# EAGLE design Color-LCD-Shield (EAGLE 5.11)
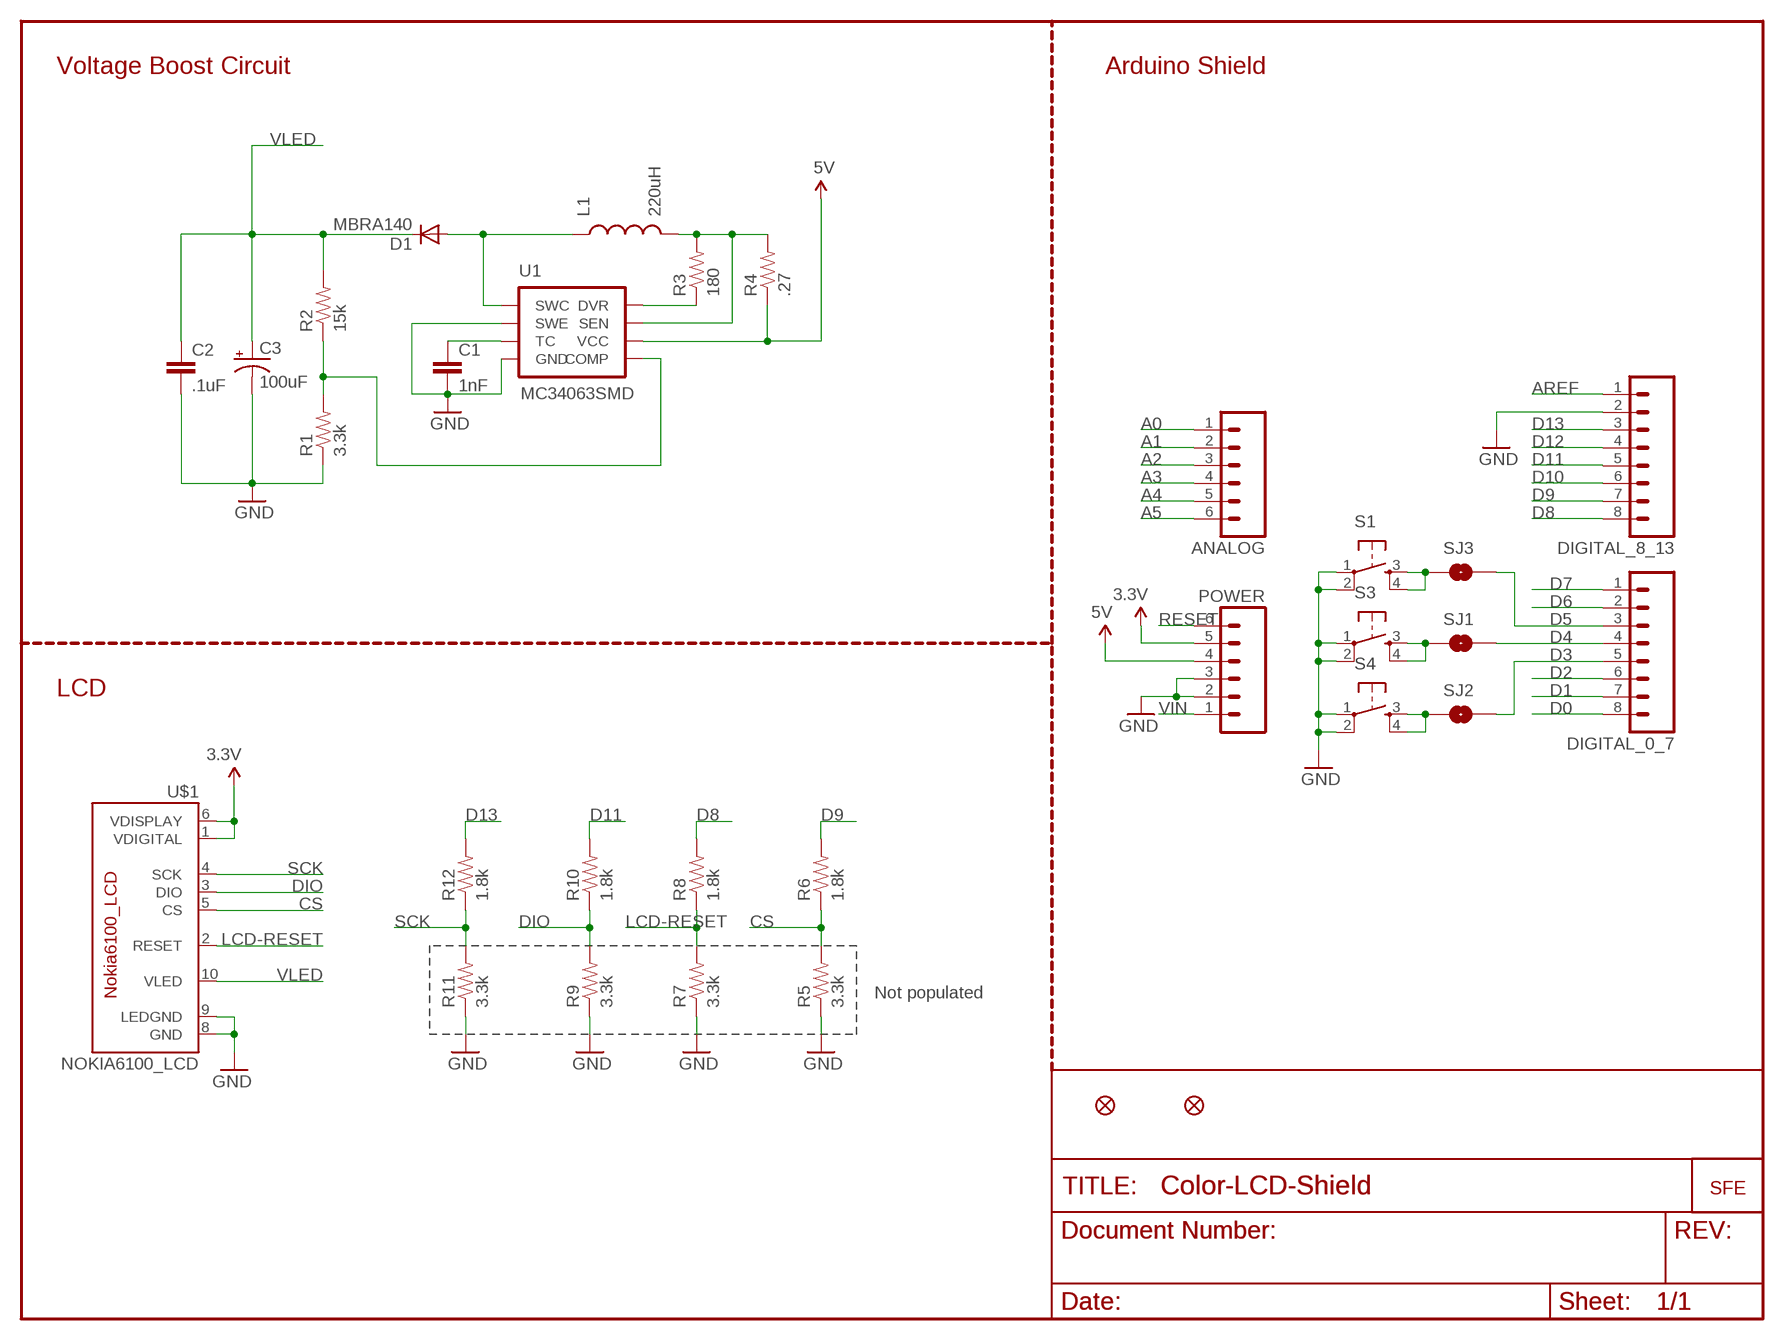
[diagram p0: schematic, sheet 1]

## Parts
ANALOG  M06SIP  [1X06]
C1  1nF  CAP0402-CAP  [0402-CAP]
C2  .1uF  CAP0402-CAP  [0402-CAP]
C3  100uF  CAP_POL7343  [EIA7343]
D1  MBRA140  DIODESMA  [SMA-DIODE]
DIGITAL_0_7  M08  [1X08]
DIGITAL_8_13  M08  [1X08]
JP1  LOGO-SFENEW  [SFE-NEW-WEBLOGO]
JP2  FIDUCIAL1X2  [FIDUCIAL-1X2]
JP3  FIDUCIAL1X2  [FIDUCIAL-1X2]
L1  220uH  INDUCTORNPI75C  [NPI75C]
POWER  M06SIP  [1X06]
R1  3.3k  RESISTOR0402-RES  [0402-RES]
R2  15k  RESISTOR0402-RES  [0402-RES]
R3  180  RESISTOR0402-RES  [0402-RES]
R4  .27  RESISTOR0402-RES  [0402-RES]
R5  3.3k  RESISTOR0402-RES  [0402-RES]
R6  1.8k  RESISTOR0402-RES  [0402-RES]
R7  3.3k  RESISTOR0402-RES  [0402-RES]
R8  1.8k  RESISTOR0402-RES  [0402-RES]
R9  3.3k  RESISTOR0402-RES  [0402-RES]
R10  1.8k  RESISTOR0402-RES  [0402-RES]
R11  3.3k  RESISTOR0402-RES  [0402-RES]
R12  1.8k  RESISTOR0402-RES  [0402-RES]
S1  TAC_SWITCHSMD  [TACTILE_SWITCH_SMD]
S3  TAC_SWITCHSMD  [TACTILE_SWITCH_SMD]
S4  TAC_SWITCHSMD  [TACTILE_SWITCH_SMD]
SJ1  SOLDERJUMPERTRACE  [SJ_2S-TRACE]
SJ2  SOLDERJUMPERTRACE  [SJ_2S-TRACE]
SJ3  SOLDERJUMPERTRACE  [SJ_2S-TRACE]
U1  MC34063SMD  [SO08]
U$1  NOKIA6100_LCD  [NOKIA6100_LCD]

## Nets
3.3V: POWER.5 U$1.1(VDIGITAL) U$1.6(VDISPLAY)
5V: POWER.4 R4.1 U1.6(VCC)
A0: ANALOG.1
A1: ANALOG.2
A2: ANALOG.3
A3: ANALOG.4
A4: ANALOG.5
A5: ANALOG.6
AREF: DIGITAL_8_13.1
CS: R5.2 R6.1 U$1.5(CS)
D0: DIGITAL_0_7.8
D1: DIGITAL_0_7.7
D2: DIGITAL_0_7.6
D3: DIGITAL_0_7.5 SJ2.2
D4: DIGITAL_0_7.4 SJ1.2
D5: DIGITAL_0_7.3 SJ3.2
D6: DIGITAL_0_7.2
D7: DIGITAL_0_7.1
D8: DIGITAL_8_13.8 R8.2
D9: DIGITAL_8_13.7 R6.2
D10: DIGITAL_8_13.6
D11: DIGITAL_8_13.5 R10.2
D12: DIGITAL_8_13.4
D13: DIGITAL_8_13.3 R12.2
DIO: R9.2 R10.1 U$1.3(DIO)
GND: C1.2 C2.2 C3.C(-) DIGITAL_8_13.2 POWER.2 POWER.3 R1.1 R5.1 R7.1 R9.1 R11.1 S1.1 S1.2 S3.1 S3.2 S4.1 S4.2 U1.2(SWE) U1.4(GND) U$1.8(GND) U$1.9(LEDGND)
LCD-RESET: R7.2 R8.1 U$1.2(RESET)
N$4: S1.3 S1.4 SJ3.1
N$5: S3.3 S3.4 SJ1.1
N$6: S4.3 S4.4 SJ2.1
N$9: R1.2 R2.1 U1.5(COMP)
N$10: C1.1 U1.3(TC)
N$13: D1.A L1.1 U1.1(SWC)
N$14: R3.1 U1.8(DVR)
N$15: L1.2 R3.2 R4.2 U1.7(SEN)
RESET: POWER.6
SCK: R11.2 R12.1 U$1.4(SCK)
VIN: POWER.1
VLED: C2.1 C3.A(+) D1.C R2.2 U$1.10(VLED)

## Notes on the sheet
- Voltage Boost Circuit | Arduino Shield
- LCD
- Not populated

## Library data of the parts
ANALOG POWER = SparkFun:M06: Header 6 Standard 6-pin 0.1" header. Use with straight break away headers (SKU : PRT-00116), right angle break away headers (PRT-00553), swiss pins (PRT-00743), machine pins (PRT-00117), and female headers (PRT-00115). Molex polarized connector foot print use with SKU : PRT-08094 with associated crimp pins and housings. NOTES ON THE VARIANTS LOCK and LOCK_LONGPADS... This footprint was designed to help hold the alignment of a through-hole component (i.e. 6-pin header) while soldering it into place. You may notice that each hole has been shifted either up or down by 0.005 of an inch from it's more standard position (which is a perfectly straight line). This slight alteration caused the pins (the squares in the middle) to touch the edges of the holes. Because they are alternating, it causes a "brace" to hold the component in place. 0.005 has proven to be the perfect amount of "off-center" position when using our standard breakaway headers. Although looks a little odd when you look at the bare footprint, once you have a header in there, the alteration is very hard to notice. Also, if you push a header all the way into place, it is covered up entirely on the bottom side. This idea of altering the position of holes to aid alignment will be further integrated into the Sparkfun Library for other footprints. It can help hold any component with 3 or more connection pins.
C1 C2 = SparkFun:CAP: Capacitor Standard 0603 ceramic capacitor, and 0.1" leaded capacitor.
C3 = SparkFun:CAP_POL: Capacitor Polarized These are standard SMD and PTH capacitors. Normally 10uF, 47uF, and 100uF in electrolytic and tantalum varieties. Always verify the external diameter of the through hole cap, it varies with capacity, voltage, and manufacturer. The EIA devices should be standard.
D1 = SparkFun:DIODE: Diode These are standard reverse protection diodes and small signal diodes. SMA package can handle up to about 1A. SOD-323 can handle about 200mA. What the SOD-323 package when ordering, there are some mfgs out there that are 5-pin packages.
DIGITAL_0_7 DIGITAL_8_13 = SparkFun:M08: Header 8 Standard 8-pin 0.1" header. Use with straight break away headers (SKU : PRT-00116), right angle break away headers (PRT-00553), swiss pins (PRT-00743), machine pins (PRT-00117), and female headers (PRT-00115).
JP1 = SparkFun:LOGO-SFE: Spark Fun Electronics PCB Logo This is the standard Spark Fun Electronics PCB logo.
JP2 JP3 = SparkFun:FIDUCIAL: Fiducial Alignment Points Various fiducial points for machine vision alignment.
L1 = SparkFun:INDUCTOR: Inductors Basic Inductor/Choke - 0603 and 1206. Footprints are not proven and vary greatly between part numbers.
R1-R12 = SparkFun:RESISTOR: Resistor Basic schematic elements and footprints for 0603, 1206, and PTH resistors.
S1 S3 S4 = SparkFun:TAC_SWITCH: Momentary Switch Button commonly used for reset or general input. Spark Fun Electronics SKU : COM-00097
SJ1-SJ3 = SparkFun:SOLDERJUMPER: Solder Jumper Standard SMD solder jumper. Used to automate production. Two varients : Normally Open and Normally Closed are the same, but have different paste layers. NC will have a large amount of paste and should jumper during reflow.
U1 = SparkFun:MC34063
U$1 = SparkFun:NOKIA6100_LCD: Nokia 6100 Color LCD Schematic element and footprint production proven but could use some touching up. Spark Fun Electronics SKU : LCD-00569. Mating SMD connector : LCD-00570

## Board
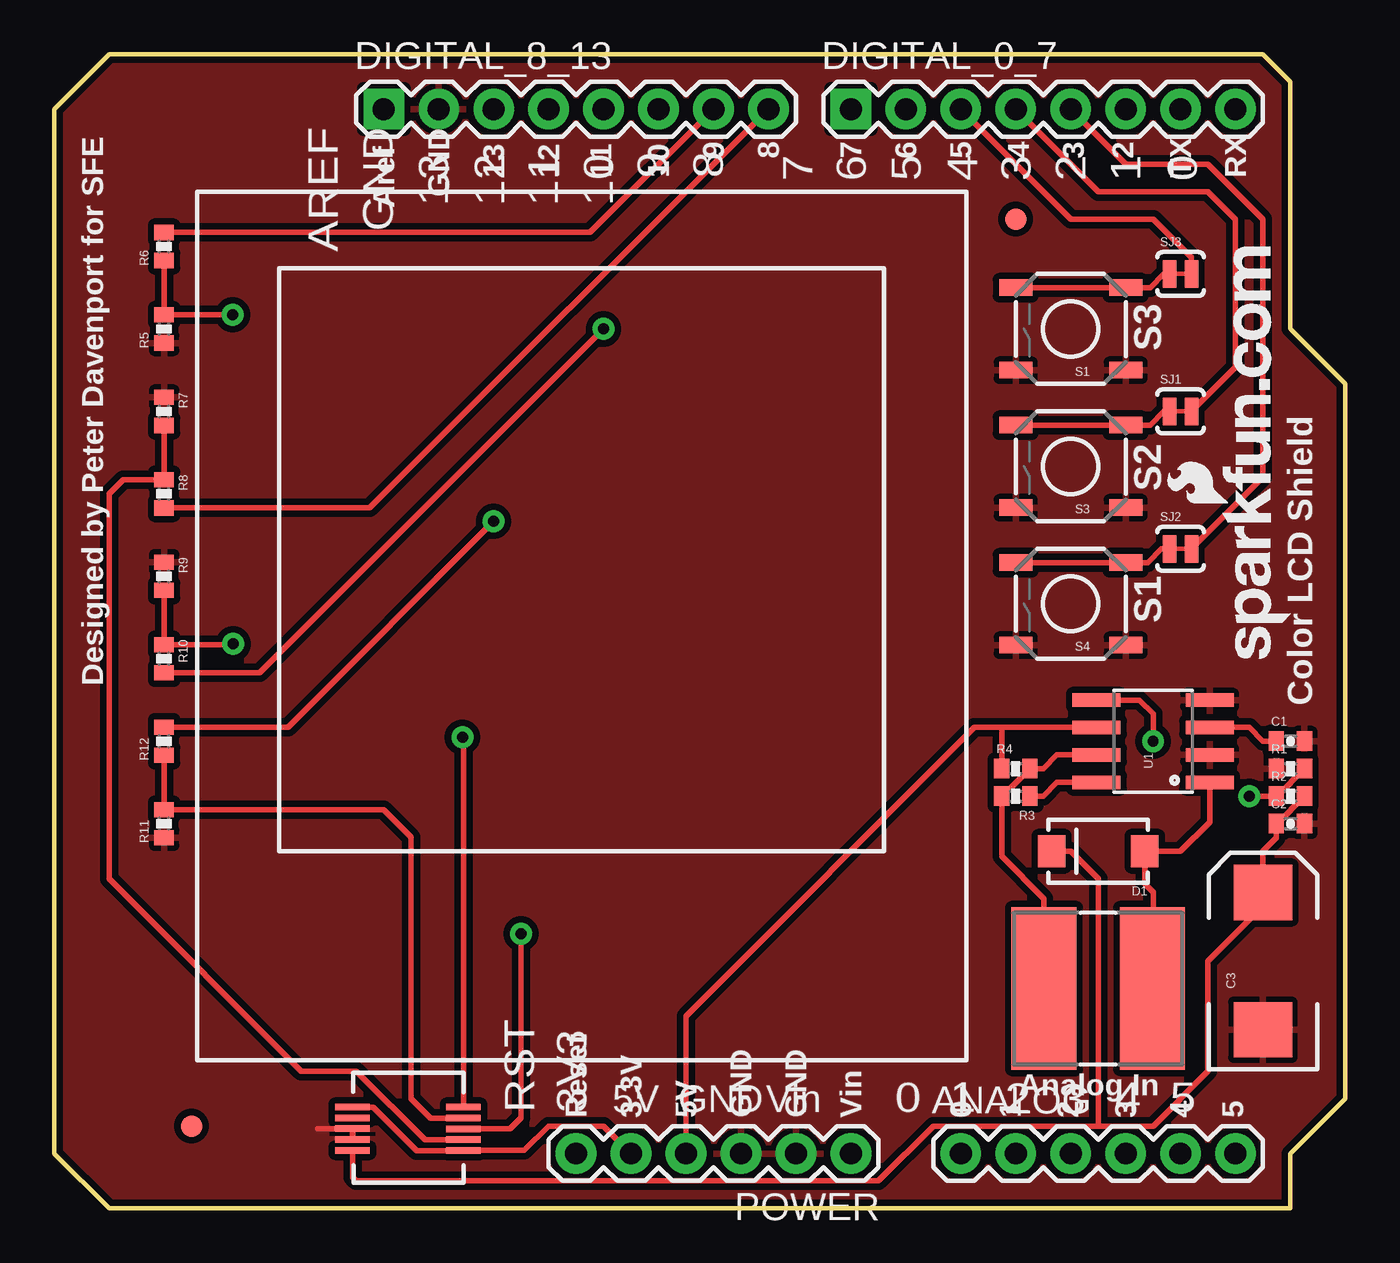
[diagram p1: board, top side]
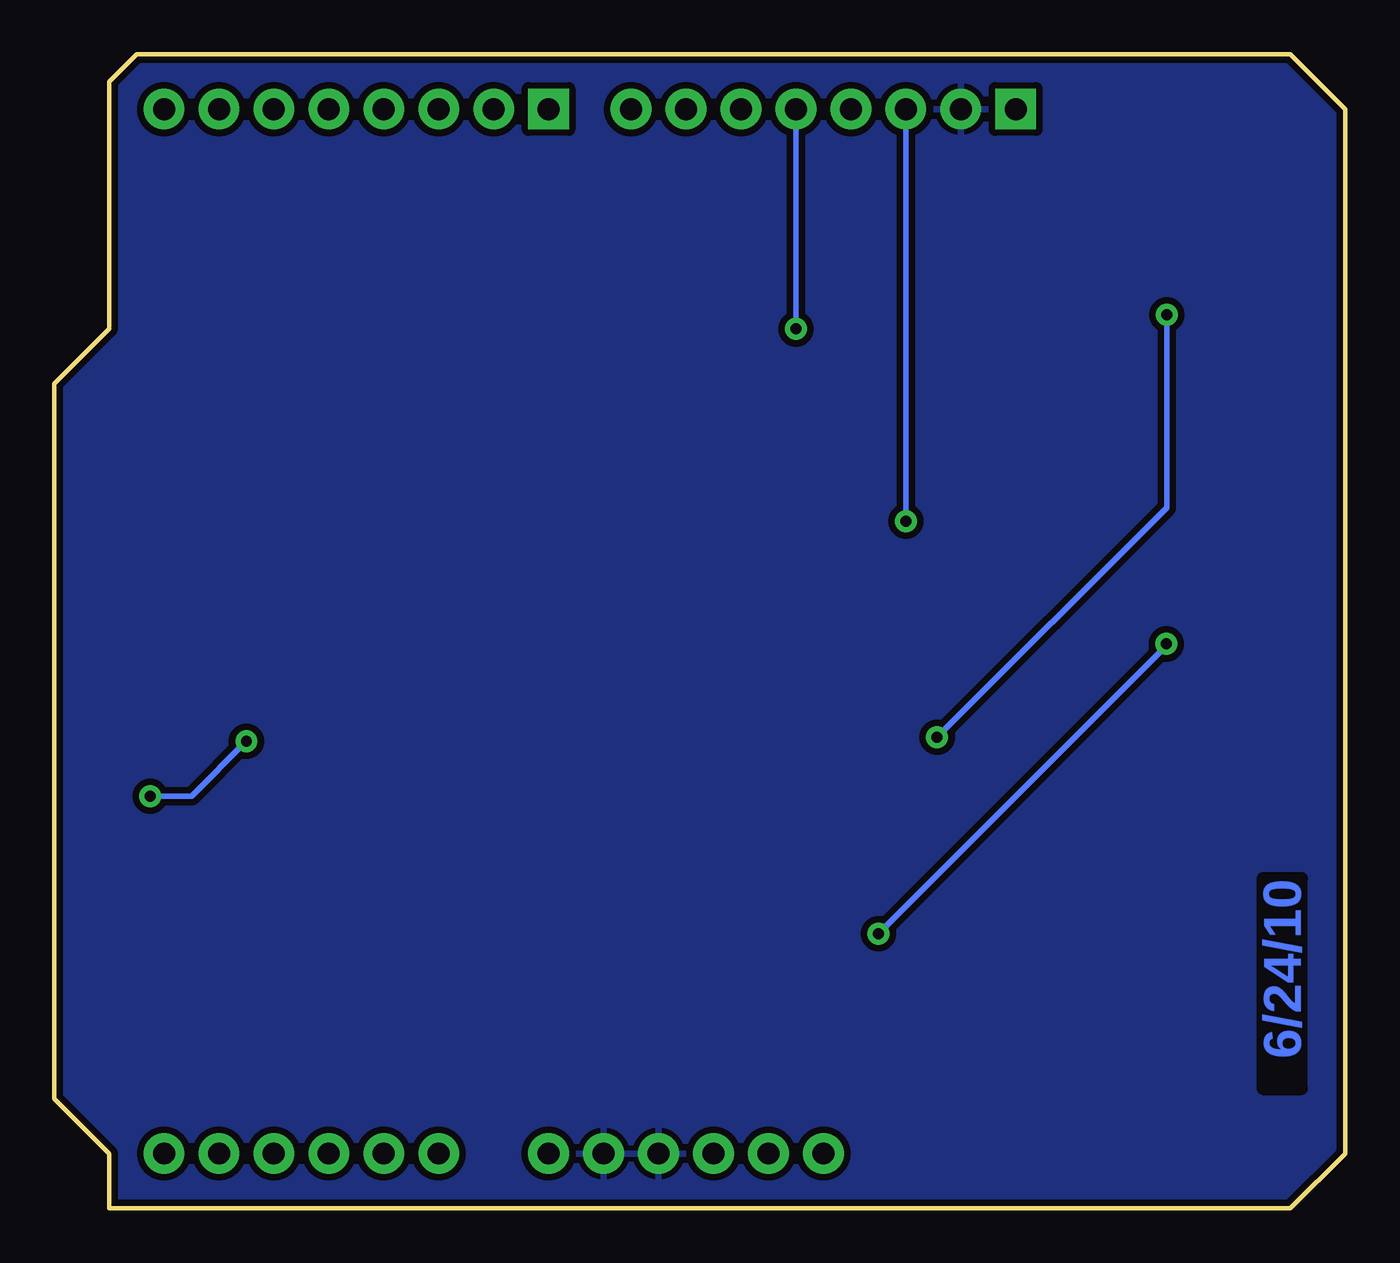
[diagram p2: board, bottom side, seen from below]

Size 59.69 x 53.34 mm. Coordinates in mm from the lower left corner, seen from the top.
Outline: 2.54,0 0,2.54 0,50.8 2.54,53.34 55.88,53.34 57.15,52.07 57.15,40.64 59.69,38.1 59.69,5.08 57.15,2.54 57.15,0 2.54,0
Copper layers (1*16): Top 0.035mm / dielectric 1.5mm / Bottom 0.035mm
Design rules "SparkFun": minimum track width 8mil, minimum drill 20mil, track to track 8mil, track to pad 8mil, pad to pad 8mil, via to via 8mil, smd to smd 8mil, copper to edge 9mil, drill to drill 8mil, minimum pad ring 12mil, minimum via ring 10mil, stop-mask expansion 4mil, vias tented up to drill 20mil, thermal gap 10mil

### Footprints (pad centres in the part's own frame; a part is rotated, then mirrored left to right if it is on the bottom)
1X06 = drill 1.016 pad 1.88 round: 1 0,0; 2 2.54,0; 3 5.08,0; 4 7.62,0; 5 10.16,0; 6 12.7,0
0402-CAP = smd 0.7 x 0.9: 1 -0.65,0; 2 0.65,0
EIA7343 = smd 2.55 x 2.7: A 3.17,0; C -3.17,0
SMA-DIODE = smd 1.27 x 1.47: A -2.15,0; C 2.15,0
1X08 = drill 1.016 pad 1.88 square: 1 0,0 | drill 1.016 pad 1.88 round: 2 2.54,0; 3 5.08,0; 4 7.62,0; 5 10.16,0; 6 12.7,0; 7 15.24,0; 8 17.78,0
FIDUCIAL-1X2 = smd 1 x 1: 1 0,0
NPI75C = smd 3 x 7.5: 1 -2.5,0; 2 2.5,0
0402-RES = smd 0.7 x 0.9: 1 -0.65,0; 2 0.65,0
TACTILE_SWITCH_SMD = smd 1.524 x 0.762: 1 -2.54,1.905; 2 2.54,1.905; 3 -2.54,-1.905; 4 2.54,-1.905
SJ_2S-TRACE = smd 0.635 x 1.27: 1 -0.508,0; 2 0.508,0
SO08 = smd 0.61 x 2.21: 1 -1.905,-2.616; 2 -0.635,-2.616; 3 0.635,-2.616; 4 1.905,-2.616; 5 1.905,2.616; 6 0.635,2.616; 7 -0.635,2.616; 8 -1.905,2.616
NOKIA6100_LCD = smd 1.6 x 0.3: 1 24.255,44.311; 2 24.255,43.811; 3 24.255,43.311; 4 24.255,42.811; 5 24.255,42.311; 6 29.389,42.303; 7 29.389,42.803; 8 29.389,43.303; 9 29.389,43.803; 10 29.389,44.303

### Placement (x,y rotation side)
ANALOG  41.91,2.54 0 top
C1  57.15,21.59 0 top
C2  57.15,17.78 0 top
C3  55.88,11.43 90 top
D1  48.26,16.51 180 top
DIGITAL_0_7  36.83,50.8 0 top
DIGITAL_8_13  15.24,50.8 0 top
JP1  57.15,25.4 90 top
JP2  6.35,3.81 0 top
JP3  44.45,45.72 0 top
L1  48.26,10.16 180 top
POWER  36.83,2.54 180 top
R1  57.15,20.32 0 top
R2  57.15,19.05 0 top
R3  44.45,19.05 180 top
R4  44.45,20.32 0 top
R5  5.08,40.64 90 top
R6  5.08,44.45 90 top
R7  5.08,36.83 270 top
R8  5.08,33.02 270 top
R9  5.08,29.21 270 top
R10  5.08,25.4 270 top
R11  5.08,17.78 90 top
R12  5.08,21.59 90 top
S1  46.99,40.64 180 top
S3  46.99,34.29 180 top
S4  46.99,27.94 180 top
SJ1  52.07,36.83 0 top
SJ2  52.07,30.48 0 top
SJ3  52.07,43.18 0 top
U1  50.8,21.59 90 top
U$1  43.18,46.99 180 top

### Tracks (layer width: path | path; a pad name or v marks a point on that pad's centre or on a via)
3.3V
  Top 0.254: U$1.6 14.74,4.69 16.76,2.67 18.41,2.67 18.43,2.68 U$1.1 21.73,2.68 22.86,3.81 25.4,3.81 POWER.5
5V
  Top 0.254: POWER.4 29.21,8.89 42.55,22.23 43.81,22.23 | 43.83,20.32 R4.1 43.8,22.21 43.81,22.23 | 43.81,22.23 U1.6
CS  (via drill 0.51)
  Top 0.254: R6.1 R5.2 8.24,41.29 v8.26,41.3 | U$1.5 18.93,21.71 v18.87,21.77
  Bottom 0.254: v8.26,41.3 8.26,32.38 v18.87,21.77
D3
  Top 0.254: DIGITAL_0_7.5 49.53,48.26 53.34,48.26 55.88,45.72 55.88,33.78 SJ2.2
D4
  Top 0.254: DIGITAL_0_7.4 48.26,46.99 53.34,46.99 54.61,45.72 54.61,38.86 SJ1.2
D5
  Top 0.254: DIGITAL_0_7.3 46.99,45.72 50.8,45.72 52.58,43.94 SJ3.2
D8
  Top 0.254: R8.2 14.59,32.37 DIGITAL_8_13.8
D9
  Top 0.254: R6.2 24.78,45.1 DIGITAL_8_13.7
D11  (via drill 0.51)
  Top 0.254: R10.2 9.51,24.75 v25.4,40.64
  Bottom 0.254: v25.4,40.64 DIGITAL_8_13.5
D13  (via drill 0.51)
  Top 0.254: R12.2 10.81,22.24 v20.32,31.75
  Bottom 0.254: v20.32,31.75 DIGITAL_8_13.3
DIO  (via drill 0.51)
  Top 0.254: U$1.3 21.08,3.68 21.59,4.19 v21.59,12.7 | R9.2 R10.1 8.24,26.05 v8.28,26.09
  Bottom 0.254: v8.28,26.09 8.28,26.01 v21.59,12.7
GND
  Top 0.254: 12.19,3.68 12.2,3.69 U$1.8 U$1.9
  pour Top (isolate 0.305): 2.54,0 0,2.54 0,50.8 2.54,53.34 55.88,53.34 57.15,52.07 57.15,40.64 59.69,38.1 59.69,5.08 57.15,2.54 57.15,0
  pour Bottom (isolate 0.305): 0,50.8 2.54,53.34 55.88,53.34 57.15,52.07 57.15,40.64 59.69,38.1 59.69,5.08 57.15,2.54 57.15,0 2.54,0 0,2.54
LCD-RESET
  Top 0.254: U$1.2 17.14,3.18 13.97,6.35 11.43,6.35 2.54,15.24 2.54,33.02 3.19,33.67 R8.1 R7.2
N$4
  Top 0.254: S1.4 S1.3 50.67,42.55 51.31,43.18 SJ3.1
N$5
  Top 0.254: SJ1.1 51.31,36.83 50.67,36.2 S3.3 S3.4
N$6
  Top 0.254: SJ2.1 51.18,30.48 50.55,29.84 S4.3 S4.4
N$9  (via drill 0.51)
  Top 0.254: R1.2 56.53,19.05 R2.1 v55.24,19.05 | U1.5 50.16,23.5 50.8,22.86 v50.8,21.59
  Bottom 0.254: v50.8,21.59 53.34,19.05 v55.24,19.05
N$10
  Top 0.254: C1.1 55.88,21.59 55.24,22.23 U1.3
N$13
  Top 0.254: U1.1 53.42,17.86 52.07,16.51 D1.A 50.41,14.99 50.8,14.61 50.8,10.2 L1.1
N$14
  Top 0.254: U1.8 46.35,19.68 45.72,19.05 R3.1
N$15
  Top 0.254: U1.7 46.35,20.95 45.72,20.32 R4.2 43.83,19.05 R3.2 43.8,16.27 45.76,14.31 L1.2
SCK
  Top 0.254: U$1.4 17.41,4.18 16.51,5.08 16.51,17.14 15.22,18.43 R11.2 R12.1
VLED
  Top 0.254: U$1.10 13.79,1.45 13.97,1.27 38.1,1.27 40.64,3.81 48.26,3.81 | R2.2 56.53,17.78 C2.1 56.5,17.13 55.88,16.51 C3.A 55.88,13.97 53.34,11.43 53.34,6.35 50.8,3.81 48.26,3.81 | D1.C 46.99,16.51 48.26,15.24 48.26,3.81

### Text on the board
Bottom: 6/24/10
tPlace: Designed by Peter Davenport for SFE | 9 | 8 | 7 | 6 | 5 | 4 | 3 | 2 | 13 | 12 | 11 | 10 | TX | RX | GND | Aref | S3 | S2 | S1 | Color LCD Shield | Analog In | Reset | 3.3V | 5V | GND | GND | Vin | 0 | 1 | 2 | 3 | 4 | 5
tNames: 9 | 8 | 7 | 6 | 5 | 4 | 3 | 2 | 1 | 0 | 13 | 12 | 11 | 10 | GND | AREF | RST | 3V3 | 5V | GND | Vin | 0 | 1 | 2 | 3 | 4 | 5